# Altium project Zynq 7000 Demo.PrjPcb (part 6 of 9)

## Sheet [9] - Z7010 B35, ADC, DAC.SchDoc: Z7010 B35, ADC, DAC
size B; Organization: Altium Limited; Address1: L3, 12a Rodborough Rd; Address2: Frenchs Forest; Address3: NSW; Address4: Australia 2086; DocumentNumber: 9; Revision: V1I1; SheetNumber: 9; SheetTotal: 16
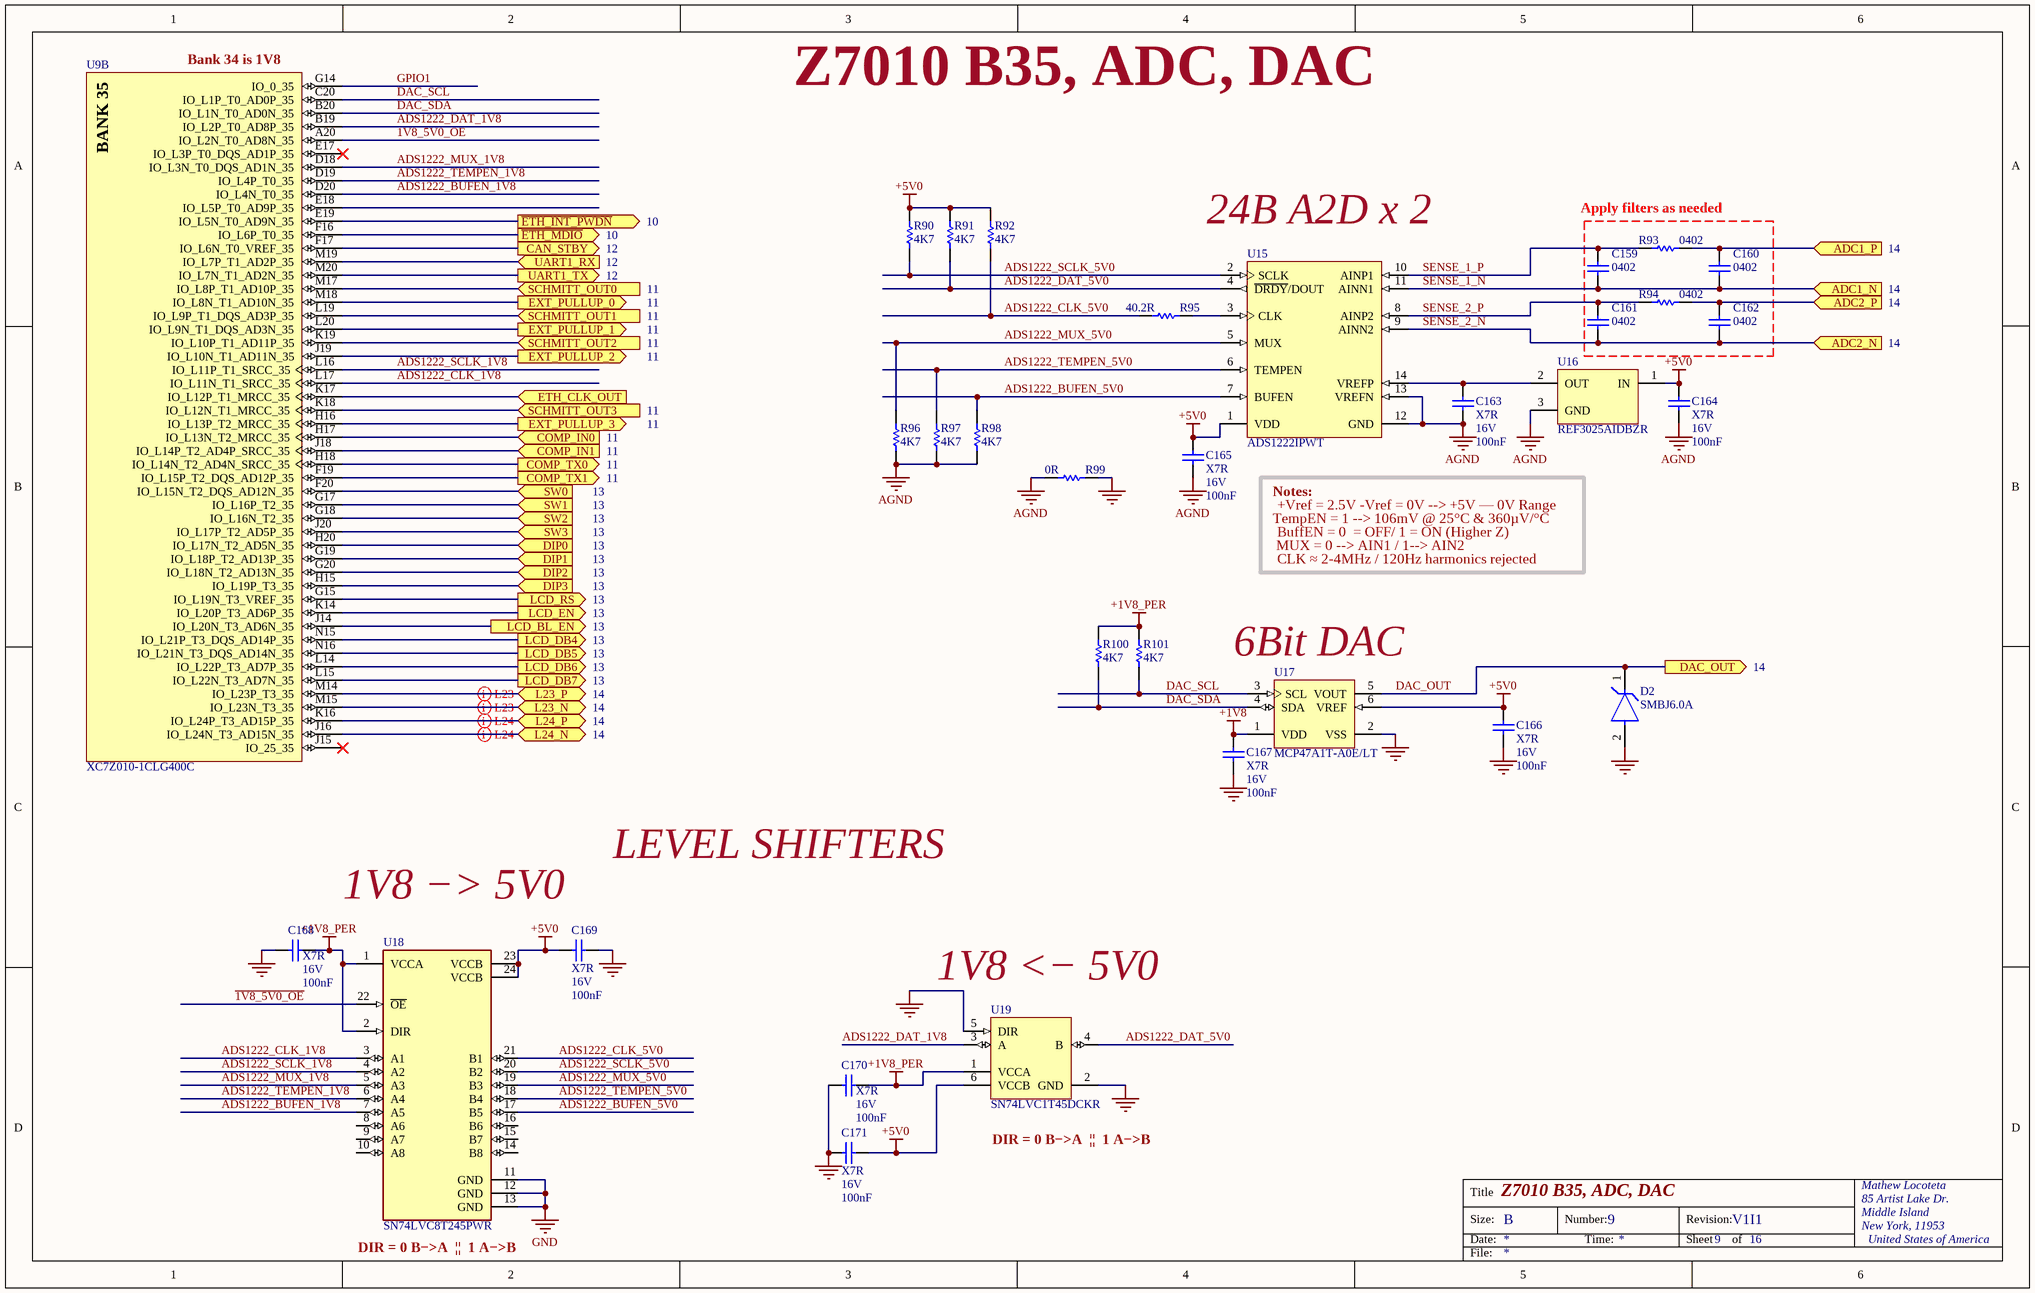
[diagram p8: [9] - Z7010 B35, ADC, DAC.SchDoc]

### Parts
C159  Case Code (Imperial): 0402  (hidden comment: 100nF 0402 16V)
C160  Case Code (Imperial): 0402  (hidden comment: 100nF 0402 16V)
C161  Case Code (Imperial): 0402  (hidden comment: 100nF 0402 16V)
C162  Case Code (Imperial): 0402  (hidden comment: 100nF 0402 16V)
C163  Dielectric: X7R  Voltage Rating: 16V  Capacitance: 100nF  (hidden comment: 100nF 0402 16V)
C164  Dielectric: X7R  Voltage Rating: 16V  Capacitance: 100nF  (hidden comment: 100nF 0402 16V)
C165  Dielectric: X7R  Voltage Rating: 16V  Capacitance: 100nF  (hidden comment: 100nF 0402 16V)
C166  Dielectric: X7R  Voltage Rating: 16V  Capacitance: 100nF  (hidden comment: 100nF 0402 16V)
C167  Dielectric: X7R  Voltage Rating: 16V  Capacitance: 100nF  (hidden comment: 100nF 0402 16V)
C168  Dielectric: X7R  Voltage Rating: 16V  Capacitance: 100nF  (hidden comment: 100nF 0402 16V)
C169  Dielectric: X7R  Voltage Rating: 16V  Capacitance: 100nF  (hidden comment: 100nF 0402 16V)
C170  Dielectric: X7R  Voltage Rating: 16V  Capacitance: 100nF  (hidden comment: 100nF 0402 16V)
C171  Dielectric: X7R  Voltage Rating: 16V  Capacitance: 100nF  (hidden comment: 100nF 0402 16V)
D2  SMBJ6.0A  [FP-SMBJ-MFG]
R90  Resistance: 4K7  (hidden comment: 4K7 0402 1%)
R91  Resistance: 4K7  (hidden comment: 4K7 0402 1%)
R92  Resistance: 4K7  (hidden comment: 4K7 0402 1%)
R93  Case/Package: 0402  (hidden comment: 40R2 1% 0402)
R94  Case/Package: 0402  (hidden comment: 40R2 1% 0402)
R95  Resistance: 40.2R  (hidden comment: 40R2 1% 0402)
R96  Resistance: 4K7  (hidden comment: 4K7 0402 1%)
R97  Resistance: 4K7  (hidden comment: 4K7 0402 1%)
R98  Resistance: 4K7  (hidden comment: 4K7 0402 1%)
R99  value 0R  [RESC1005X40X25ML05T10]  (hidden comment: CRCW04020000Z0EDHP)
R100  Resistance: 4K7  (hidden comment: 4K7 0402 1%)
R101  Resistance: 4K7  (hidden comment: 4K7 0402 1%)
U9  XC7Z010-1CLG400C  [CLG400]  (part B of 9)
U15  ADS1222IPWT  [TI-PW14_N]
U16  REF3025AIDBZR  [DBZ0003A_L]
U17  MCP47A1T-A0E/LT  [MCHP-SC70-LT6_N]
U18  SN74LVC8T245PWR  [FP-PW0024A-MFG]
U19  SN74LVC1T45DCKR  [DCK0006A_L]

### Blocks framed on the sheet
Apply filters as needed: C159-C162 R93 R94

### Ports
ADC1_N (in), ADC1_P (in), ADC2_N (in), ADC2_P (in), CAN_STBY (out), COMP_IN0 (in), COMP_IN1 (in), COMP_TX0 (out), COMP_TX1 (out), DAC_OUT (out), DIP0 (in), DIP1 (in), DIP2 (in), DIP3 (in), ETH_CLK_OUT (in), EXT_PULLUP_0 (out), EXT_PULLUP_1 (out), EXT_PULLUP_2 (out), EXT_PULLUP_3 (out), L23_N (bidir), L23_P (bidir), L24_N (bidir), L24_P (bidir), LCD_BL_EN (out), LCD_DB4 (out), LCD_DB5 (out), LCD_DB6 (out), LCD_DB7 (out), LCD_EN (out), LCD_RS (out), SCHMITT_OUT0 (in), SCHMITT_OUT1 (in), SCHMITT_OUT2 (in), SCHMITT_OUT3 (in), SW0 (in), SW1 (in), SW2 (in), SW3 (in), UART1_RX (in), UART1_TX (out), ~{ETH_INT_PWDN} (out), ~{ETH_MDIO} (out)

### Nets
+1V8: C167.2 U17.1(VDD)
+1V8_PER: C168.1 C170.1 R100.2 R101.2 U18.1(VCCA) U18.2(DIR) U19.1(VCCA)
+5V0: C164.2 C165.2 C166.2 C169.2 C171.2 R90.2 R91.2 R92.2 U15.1(VDD) U16.1(IN) U17.6(VREF) U18.23(VCCB) U18.24(VCCB) U19.6(VCCB)
AGND: C163.1 C164.1 C165.1 R96.1 R97.1 R98.1 R99.1 U15.12(GND) U15.13(VREFN) U16.3(GND)
GND: C166.1 C167.1 C168.2 C169.1 C170.2 C171.1 D2.2(A) R99.2 U17.2(VSS) U18.11(GND) U18.12(GND) U18.13(GND) U19.2(GND) U19.5(DIR)
~{1V8_5V0_OE}: U9.A20(IO_L2N_T0_AD8N_35) U18.22(~{OE})
ADC1_P: C160.2 R93.1 ; port ADC1_P
ADC2_P: C162.2 R94.1 ; port ADC2_P
ADS1222_BUFEN_1V8: U9.D20(IO_L4N_T0_35) U18.7(A5)
ADS1222_BUFEN_5V0: R98.2 U15.7(BUFEN) U18.17(B5)
ADS1222_CLK_1V8: U9.L17(IO_L11N_T1_SRCC_35) U18.3(A1)
ADS1222_CLK_5V0: R92.1 R95.2 U18.21(B1)
ADS1222_DAT_1V8: U9.B19(IO_L2P_T0_AD8P_35) U19.3(A)
ADS1222_DAT_5V0: R91.1 U15.4(~{DRDY}/DOUT) U19.4(B)
ADS1222_MUX_1V8: U9.D18(IO_L3N_T0_DQS_AD1N_35) U18.5(A3)
ADS1222_MUX_5V0: R96.2 U15.5(MUX) U18.19(B3)
ADS1222_SCLK_1V8: U9.L16(IO_L11P_T1_SRCC_35) U18.4(A2)
ADS1222_SCLK_5V0: R90.1 U15.2(SCLK) U18.20(B2)
ADS1222_TEMPEN_1V8: U9.D19(IO_L4P_T0_35) U18.6(A4)
ADS1222_TEMPEN_5V0: R97.2 U15.6(TEMPEN) U18.18(B4)
CAN_STBY: U9.F17(IO_L6N_T0_VREF_35) ; port CAN_STBY
COMP_IN0: U9.H17(IO_L13N_T2_MRCC_35) ; port COMP_IN0
COMP_IN1: U9.J18(IO_L14P_T2_AD4P_SRCC_35) ; port COMP_IN1
COMP_TX1: U9.F19(IO_L15P_T2_DQS_AD12P_35) U9.H18(IO_L14N_T2_AD4N_SRCC_35) ; port COMP_TX0, port COMP_TX1
DAC_OUT: D2.1(C) U17.5(VOUT) ; port DAC_OUT
DAC_SCL: R101.1 U9.C20(IO_L1P_T0_AD0P_35) U17.3(SCL)
DAC_SDA: R100.1 U9.B20(IO_L1N_T0_AD0N_35) U17.4(SDA)
DIP0: U9.H20(IO_L17N_T2_AD5N_35) ; port DIP0
DIP1: U9.G19(IO_L18P_T2_AD13P_35) ; port DIP1
DIP2: U9.G20(IO_L18N_T2_AD13N_35) ; port DIP2
DIP3: U9.H15(IO_L19P_T3_35) ; port DIP3
~{ETH_INT_PWDN}: U9.E19(IO_L5N_T0_AD9N_35) ; port ~{ETH_INT_PWDN}
~{ETH_MDIO}: U9.F16(IO_L6P_T0_35) ; port ~{ETH_MDIO}
ETH_CLK_OUT: U9.K17(IO_L12P_T1_MRCC_35) ; port ETH_CLK_OUT
EXT_PULLUP_0: U9.M18(IO_L8N_T1_AD10N_35) ; port EXT_PULLUP_0
EXT_PULLUP_1: U9.L20(IO_L9N_T1_DQS_AD3N_35) ; port EXT_PULLUP_1
EXT_PULLUP_2: U9.J19(IO_L10N_T1_AD11N_35) ; port EXT_PULLUP_2
EXT_PULLUP_3: U9.H16(IO_L13P_T2_MRCC_35) ; port EXT_PULLUP_3
GPIO1: U9.G14(IO_0_35)
L23_N: U9.M15(IO_L23N_T3_35) ; port L23_N
L23_P: U9.M14(IO_L23P_T3_35) ; port L23_P
L24_N: U9.J16(IO_L24N_T3_AD15N_35) ; port L24_N
L24_P: U9.K16(IO_L24P_T3_AD15P_35) ; port L24_P
LCD_BL_EN: U9.J14(IO_L20N_T3_AD6N_35) ; port LCD_BL_EN
LCD_DB4: U9.N15(IO_L21P_T3_DQS_AD14P_35) ; port LCD_DB4
LCD_DB5: U9.N16(IO_L21N_T3_DQS_AD14N_35) ; port LCD_DB5
LCD_DB6: U9.L14(IO_L22P_T3_AD7P_35) ; port LCD_DB6
LCD_DB7: U9.L15(IO_L22N_T3_AD7N_35) ; port LCD_DB7
LCD_EN: U9.K14(IO_L20P_T3_AD6P_35) ; port LCD_EN
LCD_RS: U9.G15(IO_L19N_T3_VREF_35) ; port LCD_RS
SCHMITT_OUT0: U9.M17(IO_L8P_T1_AD10P_35) ; port SCHMITT_OUT0
SCHMITT_OUT1: U9.L19(IO_L9P_T1_DQS_AD3P_35) ; port SCHMITT_OUT1
SCHMITT_OUT2: U9.K19(IO_L10P_T1_AD11P_35) ; port SCHMITT_OUT2
SCHMITT_OUT3: U9.K18(IO_L12N_T1_MRCC_35) ; port SCHMITT_OUT3
SENSE_1_N: C159.1 C160.1 U15.11(AINN1) ; port ADC1_N
SENSE_1_P: C159.2 R93.2 U15.10(AINP1)
SENSE_2_N: C161.1 C162.1 U15.9(AINN2) ; port ADC2_N
SENSE_2_P: C161.2 R94.2 U15.8(AINP2)
SW0: U9.F20(IO_L15N_T2_DQS_AD12N_35) ; port SW0
SW1: U9.G17(IO_L16P_T2_35) ; port SW1
SW2: U9.G18(IO_L16N_T2_35) ; port SW2
SW3: U9.J20(IO_L17P_T2_AD5P_35) ; port SW3
UART1_RX: U9.M19(IO_L7P_T1_AD2P_35) ; port UART1_RX
UART1_TX: U9.M20(IO_L7N_T1_AD2N_35) ; port UART1_TX
NetC163_2: C163.2 U15.14(VREFP) U16.2(OUT)
NetR95_1: R95.1 U15.3(CLK)

Not connected (* = marked no-connect by the designer): U9 E17(IO_L3P_T0_DQS_AD1P_35)* E18(IO_L5P_T0_AD9P_35) J15(IO_25_35)*; U18 8(A6) 9(A7) 10(A8) 14(B8) 15(B7) 16(B6)

### Layout directives
differential pair: L23_N, L23_P, L24_N, L24_P

### Notes on the sheet
- (near U9) Bank 34 is 1V8
- Z7010 B35, ADC, DAC
- 10
- (near U15) 24B A2D x 2
- 12
- 11
- 14
- 13
- Notes:
- +Vref = 2.5V -Vref = 0V --> +5V — 0V Range
- BuffEN = 0  = OFF/ 1 = ON (Higher Z)
- CLK ≈ 2-4MHz / 120Hz harmonics rejected
- TempEN = 1 --> 106mV @ 25°C & 360µV/°C
- MUX = 0 --> AIN1 / 1--> AIN2
- (near U17) 6Bit DAC
- 1V8 −> 5V0
- LEVEL SHIFTERS
- (near U19) 1V8 <− 5V0
- (near U19) DIR = 0 B−>A  ||  1 A−>B
- (near U18) DIR = 0 B−>A  ||  1 A−>B
- Title
- Size:
- Date:
- B
- Number:
- Time:
- Revision:
- Sheet
- of
- Mathew Locoteta
- 85 Artist Lake Dr.
- Middle Island
- New York, 11953
- United States of America
- File:
- (in symbol CMP-0363-00007-3, part B) BANK 35

### Library data of the parts
C159-C171 = C0402C104J4RACTU: KEMET - C0402C104J4RACTU - SMD Multilayer Ceramic Capacitor, 0.1 µF, 16 V, 0402 [1005 Metric], ± 5%, X7R, C Series KEMET; Dissipation Factor: 3.5%; Supplier 1: Digi-Key; Manufacturer: KEMET; Manufacturer Part Number: C0402C104J4RACTU; RoHS: Yes; Category: Ceramic Capacitors; Stock 1: 106350; Pricing 1: 1=0.48000, 10=0.33900, 50=0.25620, 100=0.22310, 500=0.16528, 1000=0.14049, 2500=0.13223, 5000=0.12396 (USD); Mount: Surface Mount,PCB; Case/Package: 0402; Case Code (Metric): 1005; Dielectric Material: Ceramic; Contact Plating: Tin,Matte; Min Operating Temperature: -55°C; Max Operating Temperature: 125°C; Tolerance: 5%; Packaging: Tape and Reel; Package Quantity: 1; Termination: SMD/SMT; Voltage: 16V; Length: 1mm; Height: 0.5mm; Width: 0.02inch; Thickness: 0.022inch; Depth: 0.5mm; Radiation Hardening: No; REACH SVHC: No SVHC; ComponentLink1URL: https://datasheet.ciiva.com/5415/kem-c1002-x7r-smd-5415819.pdf?src-supplier=Mouser; ComponentLink1Description: https://datasheet.ciiva.com/5415/kem-c1002-x7r-smd-5415819.pdf?src-supplier=Mouser; ComponentLink2URL: https://datasheet.ciiva.com/46424/1851736-46424159.pdf?src-supplier=Element14; ComponentLink2Description: https://datasheet.ciiva.com/46424/1851736-46424159.pdf?src-supplier=Element14; Supplier Part Number 1: 399-7761-1-ND; Voltage Rating (DC): 16V
  C159-C162: Dielectric: X7R; Voltage Rating: 16V; Capacitance: 100nF
  C163-C171: Case Code (Imperial): 0402
D2 = CMP-08607-000069-1: TVS DIODE 6V 10.3V DO214AA; Manufacturer: Littelfuse Inc; Breakdown Voltage: 6.67V; Direction: Unidirectional; Number Of Channels: 1; Peak Pulse Power: 600W; Peak Pulse Current: 58.3A; Max Junction Temp: +150°C; Category: Diode; ComponentLink2Description: Datasheet; Octopart: https://octopart.com/smbj6.0a-littelfuse-66100; Clamping Voltage: 10.3V; Device Class L3: unset; Temperature Range Low: -65°C; Temperature: -65°C to +150°C; ComponentLink2URL: https://www.littelfuse.com/~/media/electronics/datasheets/tvs_diodes/littelfuse_tvs_diode_smbj_datasheet.pdf.pdf; Height: 2.61mm; Digikey Description: TVS DIODE 6V 10.3V DO214AA; Manufacturer Part Number: SMBJ6.0A; Temperature Range High: +150°C; Device Class L2: TVS Diodes; Mouser Description: In a Pack of 10, Littelfuse SMBJ6.0A, Uni-Directional TVS Diode, 600W, 2-Pin DO-214AA; Automotive: No; RoHS: TRUE; Device Class L1: Circuit Protection; Reverse Standoff Voltage: 6V; Lead Free: Yes; Package: SMBJ
R90-R92 R96-R98 R100 R101 = CRCW04024K70FKED: Resistor SMD 4.7 kOhm 0402 PU=10000 ST, CRCW04024K70FKED, Vishay; Power Rating: 63mW; Temperature Coefficient: 100ppm/°C; Voltage Rating: 50V; Supplier 1: Digi-Key; Manufacturer: Vishay; Manufacturer Part Number: CRCW04024K70FKED; RoHS: Yes; Category: Chip SMD Resistors; Stock 1: 575743; Pricing 1: 1=0.10000, 10=0.03500, 100=0.01410, 1000=0.00633, 2500=0.00550, 5000=0.00454 (USD); Mount: Surface Mount; Case/Package: 0402; Weight: 2.3E-05oz; Contact Plating: Tin; Case Code (Imperial): 0402; Case Code (Metric): 1005; Min Operating Temperature: -55°C; Max Operating Temperature: 155°C; Tolerance: 1%; Composition: Thick Film; Packaging: Tape and Reel; Package Quantity: 10; Termination: SMD/SMT; Military Standard: Not; Voltage Rating (DC): 50V; Number of Terminations: 2; Max Power Dissipation: 63mW; Features: Automotive AEC-Q200; Length: 1mm; Height: 0.35mm; Width: 0.5mm; Depth: 0.5mm; Radiation Hardening: No; Lead Free: Lead Free; REACH SVHC: Unknown; ComponentLink1URL: https://datasheet.ciiva.com/11808/0900766b80d98824-11808622.pdf?src-supplier=RSComponents; ComponentLink1Description: https://datasheet.ciiva.com/11808/0900766b80d98824-11808622.pdf?src-supplier=RSComponents; ComponentLink2URL: https://datasheet.ciiva.com/3256/dcrcwe3-3256597.pdf?src-supplier=Avnet; ComponentLink2Description: https://datasheet.ciiva.com/3256/dcrcwe3-3256597.pdf?src-supplier=Avnet; ComponentLink3URL: https://datasheet.ciiva.com/5550/dcrcwe3-109170-5550295.pdf?src-supplier=Mouser; ComponentLink3Description: https://datasheet.ciiva.com/5550/dcrcwe3-109170-5550295.pdf?src-supplier=Mouser; ComponentLink4URL: https://datasheet.ciiva.com/16764/70201119-16764281.pdf?src-supplier=Allied+Electronics; ComponentLink4Description: https://datasheet.ciiva.com/16764/70201119-16764281.pdf?src-supplier=Allied+Electronics; ComponentLink5URL: https://datasheet.ciiva.com/2463/dcrcwe3-2463034.pdf?src-supplier=Digi-Key; ComponentLink5Description: https://datasheet.ciiva.com/2463/dcrcwe3-2463034.pdf?src-supplier=Digi-Key; ComponentLink6URL: https://datasheet.ciiva.com/16881/dcrcwe3-16881690.pdf?src-supplier=Avnet+Europe; ComponentLink6Description: https://datasheet.ciiva.com/16881/dcrcwe3-16881690.pdf?src-supplier=Avnet+Europe; ComponentLink7URL: https://datasheet.ciiva.com/2463/dcrcwe3-2463035.pdf?src-supplier=Digi-Key; ComponentLink7Description: https://datasheet.ciiva.com/2463/dcrcwe3-2463035.pdf?src-supplier=Digi-Key; ComponentLink8URL: https://datasheet.ciiva.com/8079/1697337-8079643.pdf?src-supplier=Element14; ComponentLink8Description: https://datasheet.ciiva.com/8079/1697337-8079643.pdf?src-supplier=Element14; ComponentLink9URL: https://datasheet.ciiva.com/2463/dcrcwe3-2463036.pdf?src-supplier=Digi-Key; ComponentLink9Description: https://datasheet.ciiva.com/2463/dcrcwe3-2463036.pdf?src-supplier=Digi-Key; ComponentLink10URL: https://datasheet.ciiva.com/26316/fld-crcw-e3-data-en-26316654.pdf?src-supplier=Distrelec; ComponentLink10Description: https://datasheet.ciiva.com/26316/fld-crcw-e3-data-en-26316654.pdf?src-supplier=Distrelec; Supplier Part Number 1: 541-4.70KLCT-ND
R93 R94 = CRCW040240R2FKED: RES SMD 40.2 OHM 1% 1/16W 0402; Manufacturer: Vishay; Temperature Coefficient: 100ppm/°C; Power Rating: 63mW; Voltage Rating: 50V; Resistance: 40.2R; Supplier 1: Digi-Key; Manufacturer Part Number: CRCW040240R2FKED; RoHS: Yes; Category: Chip SMD Resistors; Stock 1: 50000; Pricing 1: 1=0.10000, 10=0.03500, 100=0.01410, 1000=0.00633, 2500=0.00550, 5000=0.00454 (USD); Mount: Surface Mount; Number of Pins: 2; Weight: 2.3E-05oz; Contact Plating: Tin; Case Code (Metric): 1005; Case Code (Imperial): 0402; Min Operating Temperature: -55°C; Max Operating Temperature: 155°C; Tolerance: 1%; Composition: Thick Film; Packaging: Tape and Reel; Termination: SMD/SMT; Package Quantity: 10; Number of Terminations: 2; Max Power Dissipation: 63mW; Features: Automotive AEC-Q200; Military Standard: Not; Voltage Rating (DC): 50V; Length: 1mm; Height: 0.35mm; Width: 0.02inch; Depth: 0.5mm; Radiation Hardening: No; Lead Free: Lead Free; REACH SVHC: Unknown; ComponentLink1URL: https://datasheet.ciiva.com/11818/0900766b80d98824-11818096.pdf?src-supplier=RSComponents; ComponentLink1Description: https://datasheet.ciiva.com/11818/0900766b80d98824-11818096.pdf?src-supplier=RSComponents; ComponentLink2URL: https://datasheet.ciiva.com/2463/dcrcwe3-2463936.pdf?src-supplier=Digi-Key; ComponentLink2Description: https://datasheet.ciiva.com/2463/dcrcwe3-2463936.pdf?src-supplier=Digi-Key; ComponentLink3URL: https://datasheet.ciiva.com/7732/1697337-7732005.pdf?src-supplier=Element14; ComponentLink3Description: https://datasheet.ciiva.com/7732/1697337-7732005.pdf?src-supplier=Element14; ComponentLink4URL: https://datasheet.ciiva.com/16882/dcrcwe3-16882343.pdf?src-supplier=Avnet+Europe; ComponentLink4Description: https://datasheet.ciiva.com/16882/dcrcwe3-16882343.pdf?src-supplier=Avnet+Europe; ComponentLink5URL: https://datasheet.ciiva.com/16784/70201119-16784936.pdf?src-supplier=Allied+Electronics; ComponentLink5Description: https://datasheet.ciiva.com/16784/70201119-16784936.pdf?src-supplier=Allied+Electronics; ComponentLink6URL: https://datasheet.ciiva.com/3256/dcrcwe3-3256507.pdf?src-supplier=Avnet; ComponentLink6Description: https://datasheet.ciiva.com/3256/dcrcwe3-3256507.pdf?src-supplier=Avnet; ComponentLink7URL: https://datasheet.ciiva.com/22872/70201119-22872251.pdf?src-supplier=Allied+Electronics; ComponentLink7Description: https://datasheet.ciiva.com/22872/70201119-22872251.pdf?src-supplier=Allied+Electronics; ComponentLink8URL: https://datasheet.ciiva.com/2463/dcrcwe3-2463934.pdf?src-supplier=Digi-Key; ComponentLink8Description: https://datasheet.ciiva.com/2463/dcrcwe3-2463934.pdf?src-supplier=Digi-Key; ComponentLink9URL: https://datasheet.ciiva.com/2463/dcrcwe3-2463935.pdf?src-supplier=Digi-Key; ComponentLink9Description: https://datasheet.ciiva.com/2463/dcrcwe3-2463935.pdf?src-supplier=Digi-Key; Supplier Part Number 1: 541-40.2LDKR-ND
R95 = CRCW040240R2FKED: RES SMD 40.2 OHM 1% 1/16W 0402; Manufacturer: Vishay; Temperature Coefficient: 100ppm/°C; Power Rating: 63mW; Voltage Rating: 50V; Supplier 1: Digi-Key; Manufacturer Part Number: CRCW040240R2FKED; RoHS: Yes; Category: Chip SMD Resistors; Stock 1: 50000; Pricing 1: 1=0.10000, 10=0.03500, 100=0.01410, 1000=0.00633, 2500=0.00550, 5000=0.00454 (USD); Mount: Surface Mount; Number of Pins: 2; Weight: 2.3E-05oz; Contact Plating: Tin; Case Code (Metric): 1005; Case Code (Imperial): 0402; Min Operating Temperature: -55°C; Max Operating Temperature: 155°C; Tolerance: 1%; Composition: Thick Film; Packaging: Tape and Reel; Termination: SMD/SMT; Package Quantity: 10; Number of Terminations: 2; Max Power Dissipation: 63mW; Features: Automotive AEC-Q200; Military Standard: Not; Voltage Rating (DC): 50V; Length: 1mm; Height: 0.35mm; Width: 0.02inch; Depth: 0.5mm; Radiation Hardening: No; Lead Free: Lead Free; REACH SVHC: Unknown; ComponentLink1URL: https://datasheet.ciiva.com/11818/0900766b80d98824-11818096.pdf?src-supplier=RSComponents; ComponentLink1Description: https://datasheet.ciiva.com/11818/0900766b80d98824-11818096.pdf?src-supplier=RSComponents; ComponentLink2URL: https://datasheet.ciiva.com/2463/dcrcwe3-2463936.pdf?src-supplier=Digi-Key; ComponentLink2Description: https://datasheet.ciiva.com/2463/dcrcwe3-2463936.pdf?src-supplier=Digi-Key; ComponentLink3URL: https://datasheet.ciiva.com/7732/1697337-7732005.pdf?src-supplier=Element14; ComponentLink3Description: https://datasheet.ciiva.com/7732/1697337-7732005.pdf?src-supplier=Element14; ComponentLink4URL: https://datasheet.ciiva.com/16882/dcrcwe3-16882343.pdf?src-supplier=Avnet+Europe; ComponentLink4Description: https://datasheet.ciiva.com/16882/dcrcwe3-16882343.pdf?src-supplier=Avnet+Europe; ComponentLink5URL: https://datasheet.ciiva.com/16784/70201119-16784936.pdf?src-supplier=Allied+Electronics; ComponentLink5Description: https://datasheet.ciiva.com/16784/70201119-16784936.pdf?src-supplier=Allied+Electronics; ComponentLink6URL: https://datasheet.ciiva.com/3256/dcrcwe3-3256507.pdf?src-supplier=Avnet; ComponentLink6Description: https://datasheet.ciiva.com/3256/dcrcwe3-3256507.pdf?src-supplier=Avnet; ComponentLink7URL: https://datasheet.ciiva.com/22872/70201119-22872251.pdf?src-supplier=Allied+Electronics; ComponentLink7Description: https://datasheet.ciiva.com/22872/70201119-22872251.pdf?src-supplier=Allied+Electronics; ComponentLink8URL: https://datasheet.ciiva.com/2463/dcrcwe3-2463934.pdf?src-supplier=Digi-Key; ComponentLink8Description: https://datasheet.ciiva.com/2463/dcrcwe3-2463934.pdf?src-supplier=Digi-Key; ComponentLink9URL: https://datasheet.ciiva.com/2463/dcrcwe3-2463935.pdf?src-supplier=Digi-Key; ComponentLink9Description: https://datasheet.ciiva.com/2463/dcrcwe3-2463935.pdf?src-supplier=Digi-Key; Supplier Part Number 1: 541-40.2LDKR-ND; Case/Package: 0402
R99 = CMP-2002-03041-1: Manufacturer: Vishay Dale; Part Number: CRCW04020000Z0EDHP
U9 = CMP-0363-00007-3: 667 MHz Zynq™-7000 AP SoC, 130 PS I/O, 100 FPGA I/O, 400-Ball BGA, Speed Grade 1, Commercial Grade, Pb-Free; Flip Flops: 35200; Speed Grade: -1; LUTs: 17600; Extensible Block RAM (# 36Kb Blocks): 240 KB (60); ComponentLink6Description: PCB and Layout Guide; ComponentLink3Description: DC and AC Switching Characteristics; ComponentLink2URL: http://www.xilinx.com/support/documentation/user_guides/ug865-Zynq-7000-Pkg-Pinout.pdf; PackageReference: CLG400; ComponentLink3URL: http://www.xilinx.com/support/documentation/data_sheets/ds187-XC7Z010-XC7Z020-Data-Sheet.pdf; DatasheetVersion: v1.2; Generic Part Number: XC7Z010; ComponentLink2Description: Package Specification; ComponentLink1Description: Datasheet; PartNumber: XC7Z010-1CLG400C; ComponentLink5Description: Packaging and Pinout; Code_JEDEC: MO-275-MMAA-1; RoHS: Pb-Free; ComponentLink5URL: http://www.xilinx.com/support/documentation/user_guides/ug865-Zynq-7000-Pkg-Pinout.pdf; ComponentLink1URL: http://www.xilinx.com/support/documentation/data_sheets/ds190-Zynq-7000-Overview.pdf; ComponentLink4Description: Package File; ComponentLink4URL: http://www.xilinx.com/support/packagefiles/z7packages/xc7z010clg400pkg.txt; PackageDescription: Wire-Bond Chip-Scale BGA, Body 17 x 17 mm, 0.8 mm Pitch; PackageVersion: Rev 1.1, 09/2012; Mounting Technology: Surface Mount; ComponentLink6URL: http://www.xilinx.com/support/documentation/user_guides/ug483_7Series_PCB.pdf
U15 = CMP-0003-00776-2: 24-Bit ADC with 2-Channel Diffrential Input Multiplexer, -40 to 85 degC, 14-pin SOP (PW14), Green (RoHS & no Sb/Br); Manufacturer: Texas Instruments; Digital Supply(Min)(V): 2.7; Digital Supply(Max)(V): 5.5; SubFamily: Precision ADC (<=10MSPS); ENOB(Bits): 20; Sample Rate (max)(SPS): 240; # Input Channels: 2; Architecture: Delta-Sigma; Resolution(Bits): 24; Interface: Serial SPI; Code_JEDEC: MO-153; ComponentLink3Description: Package Specification; PartNumber: ADS1222IPWT; Mounting Technology: Surface Mount; ComponentLink3URL: http://www.ti.com/litv/pdf/mpds360; Analog Voltage AV/DD(Min)(V): 2.7; DatasheetVersion: SBAS314B; PackageDescription: 14-Pin Plastic Small Outline, Body 5 x 4.4 mm, Pitch 0.65 mm; ComponentLink2URL: http://www.ti.com/general/docs/lit/getliterature.tsp?genericPartNumber=ADS1222&fileType=pdf; ComponentLink2Description: Datasheet; ComponentLink1URL: http://www.ti.com/; ComponentLink1Description: Manufacturer URL; PackageReference: PW14; Eco-Plan: Green (RoHS & no Sb/Br); Analog Voltage AV/DD(Max)(V): 5.5; PackageVersion: 4040064-3/G, 02/2011
U16 = CMP-0367-00155-2: 2.5 V, 50 ppm / degC, 50 uA Series (Bandgap) Voltage Reference, -40 to 125 degC, 3-pin SOT-23 (DBZ), Green (RoHS & no Sb/Br); Manufacturer: Texas Instruments; SubFamily: Series Voltage Reference; Initial Accuracy @ 25/deg C(%): 0.2; Temp Coeff(Max)(ppm/ degree C): 50; VI(Min)(V): 2.501; Temp Coeff(Typ)(ppm/ degree C): 20; VI(Max)(V): 5.5; VO(V): 2.5; Rating: Catalog; Eco-Plan: Green (RoHS & no Sb/Br); ComponentLink1URL: http://www.ti.com/; ComponentLink2Description: Datasheet; Code_JEDEC: TO-236; ComponentLink3Description: Package Specification; Iq(Max)(uA): 50; ComponentLink1Description: Manufacturer URL; ComponentLink3URL: http://www.ti.com/litv/pdf/mpds108a; ComponentLink2URL: http://www.ti.com/general/docs/lit/getliterature.tsp?genericPartNumber=REF3025&fileType=pdf; Mounting Technology: Surface Mount; PartNumber: REF3025AIDBZR; DatasheetVersion: SBVS032F; PackageVersion: 4203227/B; PackageDescription: 3-Pin Plastic Small Outline, Body 2.92 x 1.3 mm, Pitch 0.95 mm; PackageReference: DBZ0003A
U17 = CMP-0188-01388-1: 6-Bit Volatile DAC with Command Code, 130 µA Typical Operating Current, -40 to 125 degC, 6-pin SC70 (LT6), Tape and Reel; Manufacturer: Microchip; ComponentLink1URL: http://www.microchip.com; ComponentLink3Description: Package Specification; ComponentLink2URL: http://ww1.microchip.com/downloads/en/DeviceDoc/25154A.pdf; ComponentLink2Description: Datasheet; ComponentLink4URL: http://www.microchip.com/MCP47A1; ComponentLink1Description: Manufacturer URL; ComponentLink3URL: http://www.microchip.com/stellent/groups/techpub_sg/documents/packagingspec/en012702.pdf; PackageDescription: 6-Lead Plastic Small Outline Transistor, 2 x 1.25 mm Body, 0.65 mm Pitch; Mounting Technology: Surface Mount; PackageReference: SC70-LT6; DatasheetVersion: Rev. A; PartNumber: MCP47A1T-A0E/LT; PackageVersion: C04-151A; ComponentLink4Description: Product URL
U18 = CMP-04899-000027-1: IC TRNSLTR BIDIRECTIONAL 24TSSOP; Manufacturer: Texas Instruments; V B Min: 1.65V; V B Max: 5.5V; Number Of Outputs: 8; Standoff Height: 0.05mm; Nominal Supply Current: 25uA; Number Of Circuits: 1; Propagation Delay: 4.3ns; Logic Function Desc: Non-Inverting; Ambient Temperature Range High: +85°C; Temperature Range Low: -40°C; Category: IC; Min Supply Voltage: 1.65V; Device Class L2: Logic ICs; Digikey Description: IC TRNSLTR BIDIRECTIONAL 24TSSOP; ComponentLink2Description: Datasheet; V A Min: 1.65V; Height: 1.2mm; Device Class L1: Integrated Circuits (ICs); Manufacturer Part Number: SN74LVC8T245PWR; Ipc Land Pattern Name: SOP65P640X120-24; Lead Free: Yes; Device Class L3: Voltage Level Shifters; Octopart: https://octopart.com/sn74lvc8t245pwr-texas+instruments-517164; RoHS: TRUE; Ambient Temperature Range Low: -40°C; Number Of Inputs: 8; Automotive: No; V A Max: 5.5V; Mouser Description: Translation - Voltage Levels 8-Bit Dual-Supply Bus Xcvr; Temperature Range High: +85°C; ComponentLink2URL: http://www.ti.com/lit/ds/symlink/sn74lvc8t245.pdf; Temperature: -40°C to +85°C; Package: PW0024A; Max Supply Voltage: 5.5V
U19 = CMP-0859-00452-3: Single-Bit Dual-Supply Bus Transceiver with Configurable Voltage Translation and 3-State Outputs, DCK0006A, LARGE T&R; Manufacturer: Texas Instruments; Rating: Catalog; Output Type: CMOS; Technology Family: LVC; Voltage(Nom)(V): 1.8,2.5,3.3,5; VCC(Max)(V): 5.5; 3-State Output: Yes; Bits(#): 1; F @ Nom Voltage(Max)(Mhz): 150; VCC(Min)(V): 1.65; ICC @ Nom Voltage(Max)(mA): 0.004; Schmitt Trigger: No; Input Type: CMOS/TTL; tpd @ Nom Voltage(Max)(ns): 15.5,8,5.8,4.4; Logic: True; Output Drive (IOL/IOH)(Max)(mA): 32/-32; Sub-Family: Dual Supply Translator; PackageReference: DCK0006A; Generic Part Number: SN74LVC1T45; DatasheetVersion: SCES515K; Operating Temperature Range(C): -40 to 85